# EAGLE design midicontroller (EAGLE 7.0.0)
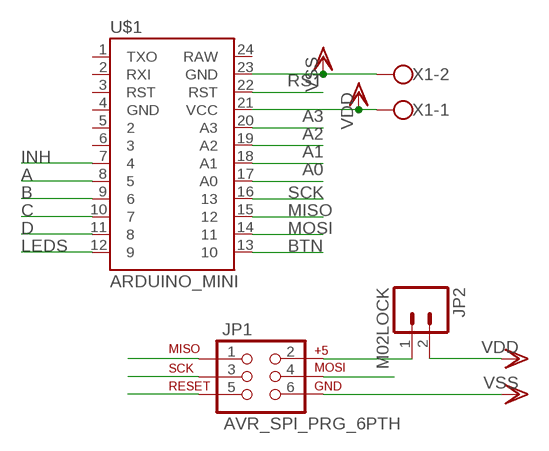
[diagram p0: schematic, sheet 1]

## Parts
JP1  AVR_SPI_PRG_6PTH  [2X3]
JP2  M02LOCK  [1X02_LOCK]
U$1  ARDUINO_MINI  [ARDUINO_MINI]
X1  W237-102  [W237-102]

## Nets
A: U$1.8
A0: U$1.17(A0)
A1: U$1.18(A1)
A2: U$1.19(A2)
A3: U$1.20(A3)
B: U$1.9
BTN: U$1.13
C: U$1.10
D: U$1.11
INH: U$1.7
LEDS: U$1.12
MISO: JP1.1 U$1.15
MOSI: JP1.4 U$1.14
N$1: JP1.2 JP2.1
RST: JP1.5 U$1.22(RST)
SCK: JP1.3 U$1.16
VDD: JP2.2 U$1.21(VCC) X1.1
VSS: JP1.6 U$1.23(GND) X1.2
Unconnected: U$1.1(TXO) U$1.2(RXI) U$1.3(RST) U$1.4(GND) U$1.5 U$1.6 U$1.24(RAW)

## Library data of the parts
JP1 = SparkFun-Connectors:AVR_SPI_PRG_6: AVR ISP 6 Pin This is the reduced ISP connector for AVR programming. Common on Arduino. This footprint will take up less PCB space and can be used with a 10-pin to 6-pin adapter such as SKU: BOB-08508 **Special note about "TEST_POINT" package. The stop mask is on the top side, so if you want your programming test points to be on the bottom of your board, make sure to place this package on the bottom side of the board. This also ensure that the orientation to program from the bottom side will be correct.
JP2 = SparkFun-Connectors:M02: Standard 2-pin 0.1" header. Use with - straight break away headers ( PRT-00116) - right angle break away headers (PRT-00553) - swiss pins (PRT-00743) - machine pins (PRT-00117) - female headers (PRT-00115) Molex polarized connector foot print use with: PRT-08233 with associated crimp pins and housings. 2.54_SCREWTERM for use with PRT-10571. 3.5mm Screw Terminal footprints for PRT-08084 5mm Screw Terminal footprints for use with PRT-08432
U$1 = SparkFun-Boards:ARDUINO_MINI: Arduino Pro Mini footprint
X1 = con-wago-500:W237-102: WAGO SCREW CLAMP; MPN: 237-102; OC_FARNELL: unknown; OC_NEWARK: 70K9898

## Board
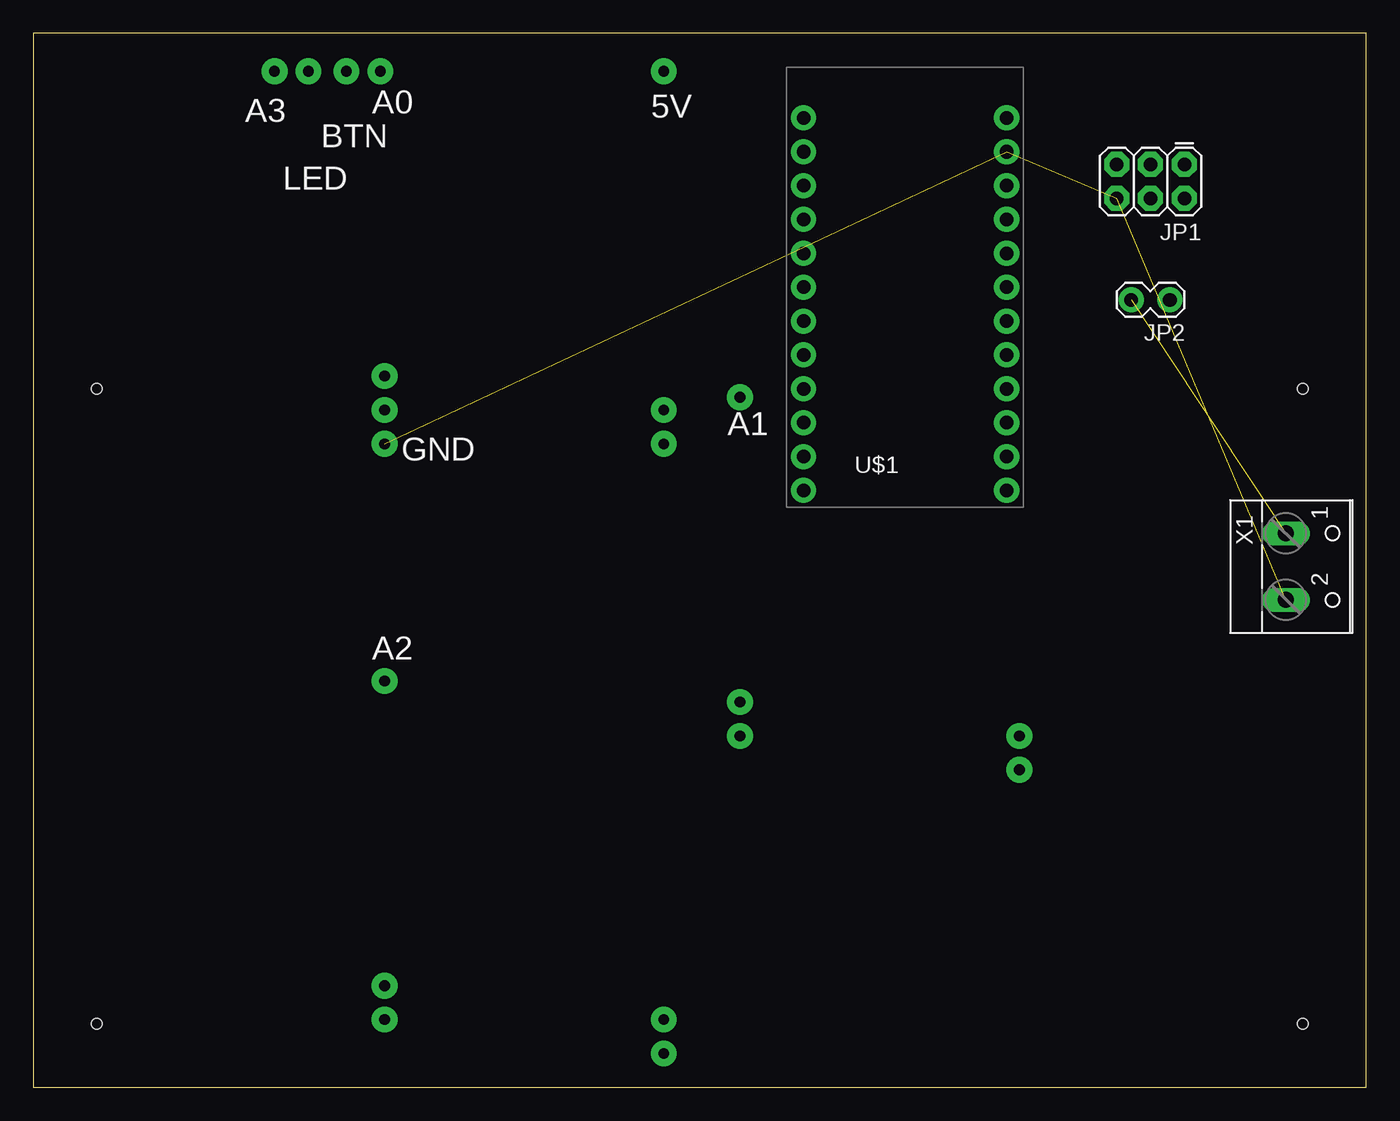
[diagram p1: board, top side]
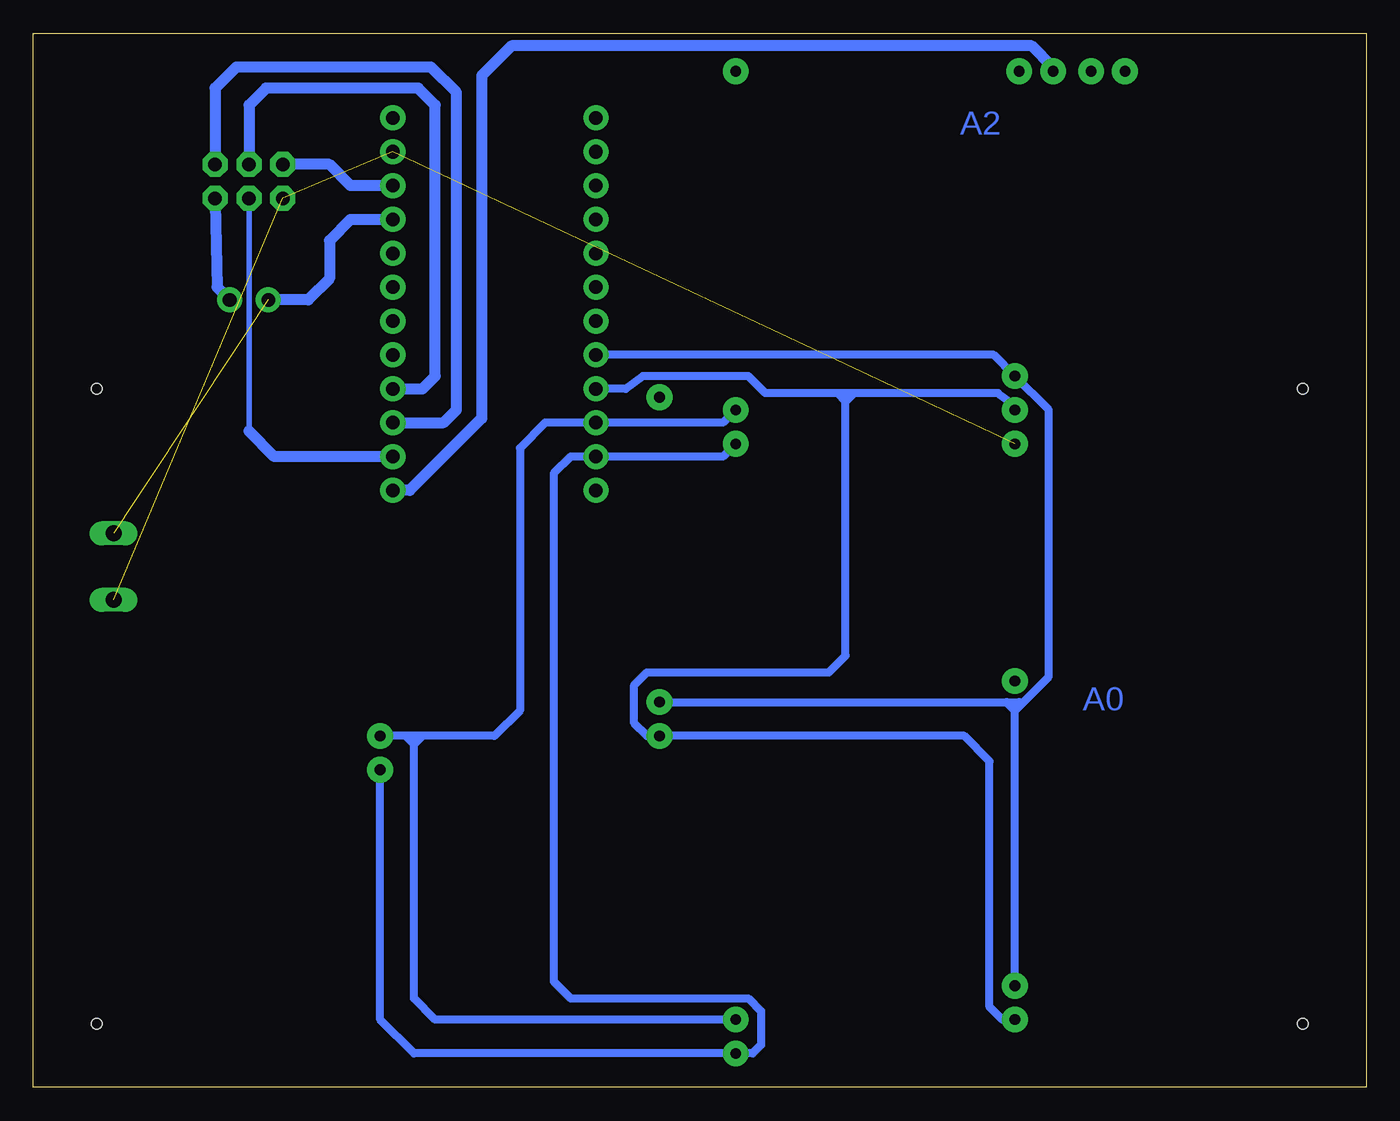
[diagram p2: board, bottom side, seen from below]

Size 100 x 79.05 mm. Coordinates in mm from the lower left corner, seen from the top.
Outline: 0,0 100,0 100,79.05 0,79.05 0,0
Copper layers (1*16): Top 0.035mm / dielectric 1.5mm / Bottom 0.035mm
Design rules "Tkkrlab-CNC": minimum track width 8mil, minimum drill 0.7mm, track to track 0.37mm, track to pad 0.37mm, pad to pad 0.37mm, via to via 0.37mm, smd to smd 0.37mm, copper to edge 20mil, drill to drill 8mil, minimum pad ring 10mil, minimum via ring 8mil, stop-mask expansion 4mil, vias tented up to drill 0mil, thermal gap 10mil
Holes 0.8 mm at 4.76,4.76 95.25,4.76 4.76,52.39 95.25,52.39

### Footprints (pad centres in the part's own frame; a part is rotated, then mirrored left to right if it is on the bottom)
2X3 = drill 1.016 pad 1.88 octagon: 1 0,0; 2 0,2.54; 3 2.54,0; 4 2.54,2.54; 5 5.08,0; 6 5.08,2.54
1X02_LOCK = drill 1.016 pad 1.88: 1 -0.178,0; 2 2.718,0
ARDUINO_MINI = drill 1.016 pad 1.88: 1 -7.62,12.7; 2 -7.62,10.16; 3 -7.62,7.62; 4 -7.62,5.08; 5 -7.62,2.54; 6 -7.62,0; 7 -7.62,-2.54; 8 -7.62,-5.08; 9 -7.62,-7.62; 10 -7.62,-10.16; 11 -7.62,-12.7; 12 -7.62,-15.24; 13 7.62,-15.24; 14 7.62,-12.7; 15 7.62,-10.16; 16 7.62,-7.62; 17 7.62,-5.08; 18 7.62,-2.54; 19 7.62,0; 20 7.62,2.54; 21 7.62,5.08; 22 7.62,7.62; 23 7.62,10.16; 24 7.62,12.7
W237-102 = drill 1.194 long: 1 -2.5,-1.27; 2 2.5,-1.27

### Placement (x,y rotation side)
JP1  86.36,69.22 180 top
JP2  85.09,59.05 180 top
U$1  65.41,60.01 0 top
X1  95.25,39.05 270 top

### Tracks (layer width: path | path; a pad name or v marks a point on that pad's centre or on a via)
A  (via drill 0.8 pad 1.93)
  Bottom 0.61: U$1.8 27.94,54.93 v26.35,53.34 23.81,50.8 23.81,30.8 25.72,28.89 | v53.02,28.89 26.99,28.89 | 26.99,28.89 26.04,28.89 | 26.04,28.89 25.72,28.89 | v26.35,7.62 26.35,28.26 | 26.35,28.26 26.35,28.57 26.04,28.89 | 26.35,28.26 26.99,28.89 | 26.35,28.26 25.72,28.89
B  (via drill 0.8 pad 1.93)
  Bottom 0.61: v26.35,50.8 26.35,51.12 27.62,52.07 38.42,52.07 | 38.42,52.07 39.05,52.07 | 39.05,52.07 39.69,52.07 | 39.69,52.07 45.09,52.07 46.35,53.34 54.29,53.34 55.56,52.39 U$1.9 | v26.35,5.08 27.3,5.08 28.26,6.03 28.26,24.45 30.16,26.35 v53.02,26.35 53.98,26.35 54.93,27.3 54.93,30.16 53.98,31.11 40.32,31.11 39.05,32.38 39.05,51.44 | 39.05,51.44 39.05,52.07 | 38.42,52.07 39.05,51.44 | 39.69,52.07 39.05,51.44
BTN  (via drill 0.8 pad 1.93)
  Bottom 0.813: v23.5,76.2 23.5,76.52 25.08,78.11 64.14,78.11 66.36,75.88 66.36,50.16 71.75,44.77 U$1.13
C  (via drill 0.8 pad 1.93)
  Bottom 0.61: v47.31,50.8 48.26,49.85 U$1.10 61.59,49.85 63.5,47.94 63.5,28.26 65.41,26.35 70.8,26.35 | 70.8,26.35 71.44,26.35 | 71.44,26.35 72.07,26.35 | 72.07,26.35 v73.98,26.35 | v47.31,5.08 69.85,5.08 71.44,6.67 71.44,25.72 | 71.44,25.72 71.44,26.35 | 71.44,25.72 72.07,26.35 | 71.44,25.72 70.8,26.35
D  (via drill 0.8 pad 1.93)
  Bottom 0.61: v47.31,48.26 48.26,47.31 U$1.11 59.69,47.31 60.96,46.04 60.96,7.94 59.69,6.67 46.35,6.67 45.4,5.71 45.4,3.17 46.04,2.54 v47.31,2.54 71.44,2.54 73.98,5.08 v73.98,23.81
MISO
  Bottom 0.813: U$1.15 69.22,49.85 68.26,50.8 68.26,74.61 70.17,76.52 84.77,76.52 86.36,74.93 JP1.1
MOSI
  Bottom 0.406: 83.82,49.21 JP1.4
  Bottom 0.813: U$1.14 81.92,47.31 83.82,49.21
N$1
  Bottom 0.813: JP1.2 86.36,66.36 86.22,60.01 JP2.1
N$2  (via drill 0.8 pad 1.93)
  other vias: 47.31,76.2
N$5  (via drill 0.8 pad 1.93)
  other vias: 53.02,51.75
N$6  (via drill 0.8 pad 1.93)
  other vias: 26.35,30.48
N$7  (via drill 0.8 pad 1.93)
  other vias: 26.04,76.2
N$8  (via drill 0.8 pad 1.93)
  other vias: 20.64,76.2
N$9  (via drill 0.8 pad 1.93)
  other vias: 18.1,76.2
RST
  Bottom 0.813: U$1.22 76.2,67.63 77.79,69.22 JP1.5
SCK
  Bottom 0.813: U$1.16 70.8,52.39 69.85,53.34 69.85,73.66 71.12,74.93 82.55,74.93 83.82,73.66 JP1.3
VDD  (1 unrouted)
  Bottom 0.813: JP2.2 79.38,59.05 77.79,60.64 77.79,63.5 76.2,65.09 U$1.21
VSS  (via drill 0.8 pad 1.93)  (3 unrouted)
  other vias: 26.35,48.26

### Text on the board
Bottom: A2 | A0
tPlace: A0 | 5V | A3 | BTN | LED | A1 | GND | A2